# Altium schematic sheet RX_Board.SchDoc (part 2 of 5)
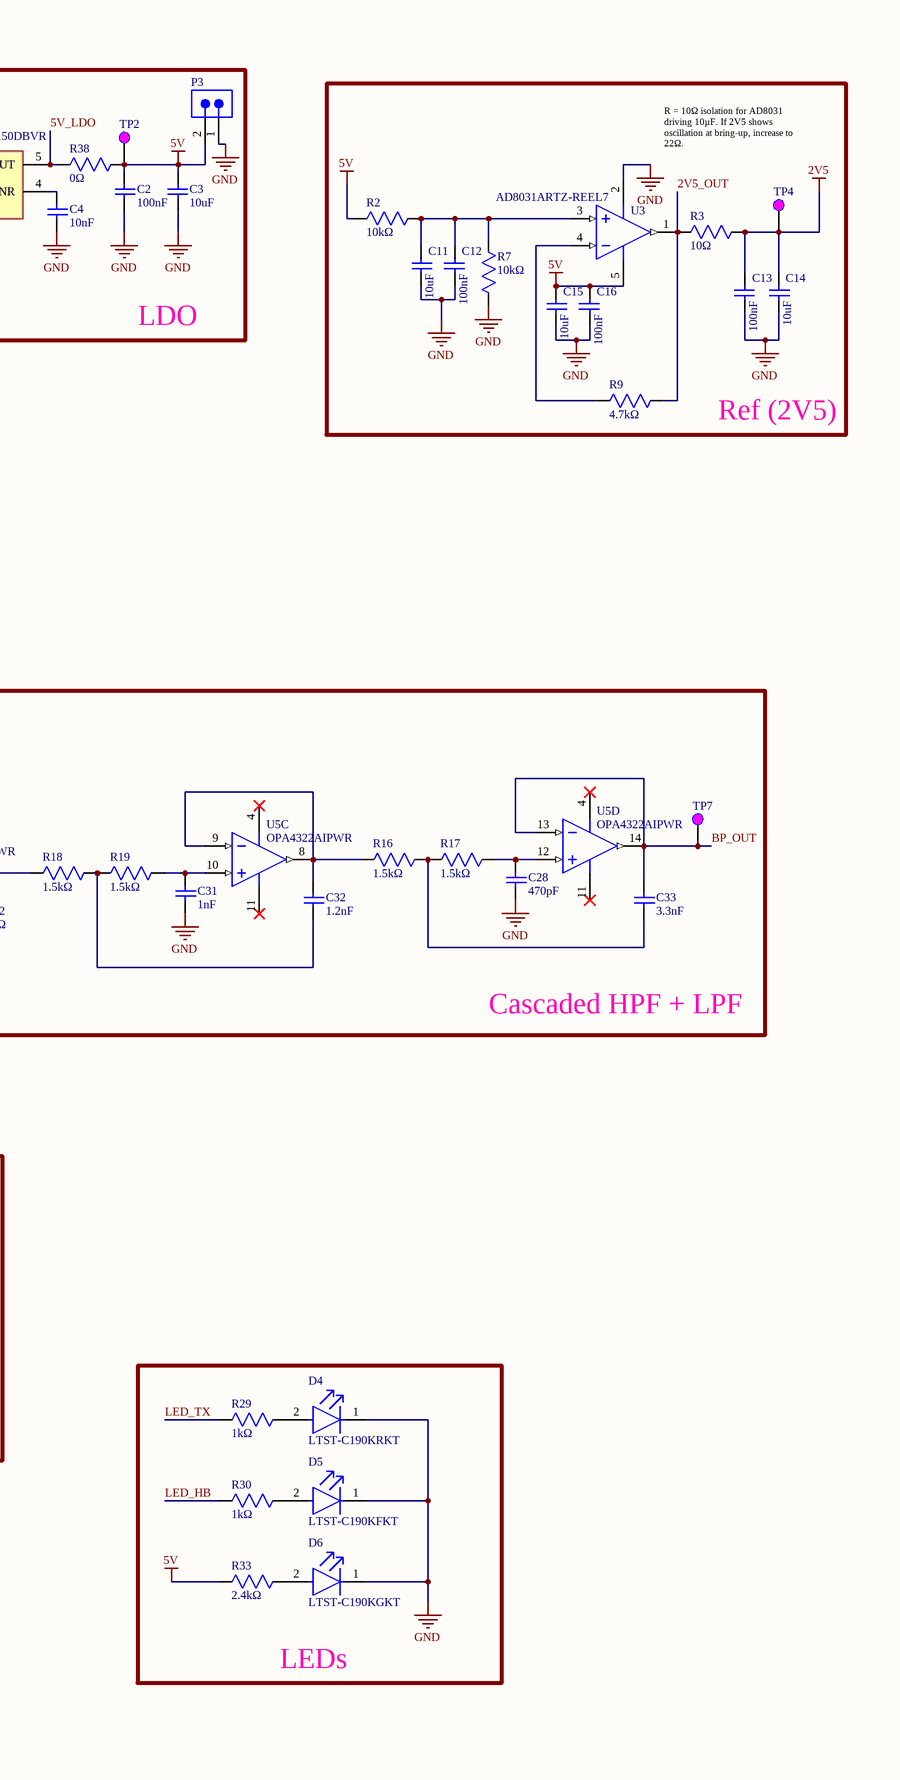
[diagram p2: RX_Board.SchDoc, right]
## Library data of the parts
C1 = CL10C150JB8NNNC: Multilayer Ceramic Capacitor, 15 pF, 50 V, ± 5%, C0G (NP0), 0603 [1608 Metric]; Manufacturer: Samsung Electro-Mechanics; Temperature Coefficient: 30ppm/°C; Voltage: 50V; Supplier: Future Electronics; Supplier Part Number: CL10C150JB8NNNC; Manufacturer Part Number: CL10C150JB8NNNC; RoHS: Compliant; Category: Ceramic Capacitors; Stock: 68000; Pricing: 4000=0.0389, 8000=0.0383, 12000=0.0379, 20000=0.0375, 40000=0.0365 (USD); Value: 15pF; Case/Package: 0603; Case Code (Imperial): 0603; Case Code (Metric): 1608; China RoHS: Compliant; Contact Plating: Tin; Country of Origin: Mainland China, Philippines, South Korea; Depth: 800µm; Dielectric: C0G; Dielectric Material: Ceramic; Export Control Classification Number (ECCN) Code: EAR99; Height: 900µm; Harmonized Tariff Schedule (HTS) Code: 8532.24.00.20; Introduction Date: 2010-02-10; Lead Free: Lead Free; Length: 1.6mm; Lifecycle Status: Production; Material: Ceramic; Max Operating Temperature: 125°C; Min Operating Temperature: -55°C; Mounting Technology: Surface Mount; Number of Terminals: 2; Radiation Hardening: No; REACH SVHC: Unaffected; Schedule B: 8532240020, 8532240020|8532240020, 8532240020|8532240020|8532240020, 8532240020|8532240020|8532240020|8532240020; Thickness: 889µm; Tolerance: 5%; Voltage Rating: 50V; Voltage Rating (DC): 50V; Width: 800µm; ComponentLink1URL: https://datasheet.octopart.com:443/CL10C150JB8NNNC-Samsung-Electro-Mechanics-datasheet-136482401.pdf?src-supplier=IHS; ComponentLink1Description: https://datasheet.octopart.com:443/CL10C150JB8NNNC-Samsung-Electro-Mechanics-datasheet-136482401.pdf?src-supplier=IHS; ComponentLink2URL: https://datasheet.octopart.com/CL10C150JB8NNNC-Samsung-Electro-Mechanics-datasheet-8324245.pdf; ComponentLink2Description: https://datasheet.octopart.com/CL10C150JB8NNNC-Samsung-Electro-Mechanics-datasheet-8324245.pdf; ComponentLink3URL: https://datasheet.octopart.com/CL10C150JB8NNNC-Samsung-Electro-Mechanics-datasheet-97040617.pdf; ComponentLink3Description: https://datasheet.octopart.com/CL10C150JB8NNNC-Samsung-Electro-Mechanics-datasheet-97040617.pdf; ComponentLink4URL: https://datasheet.octopart.com:443/CL10C150JB8NNNC-Samsung-Electro-Mechanics-datasheet-110326846.pdf?src-supplier=Future+Electronics; ComponentLink4Description: https://datasheet.octopart.com:443/CL10C150JB8NNNC-Samsung-Electro-Mechanics-datasheet-110326846.pdf?src-supplier=Future+Electronics; ComponentLink5URL: https://datasheet.octopart.com:443/CL10C150JB8NNNC-Samsung-Electro-Mechanics-datasheet-81461981.pdf?src-supplier=Future+Electronics; ComponentLink5Description: https://datasheet.octopart.com:443/CL10C150JB8NNNC-Samsung-Electro-Mechanics-datasheet-81461981.pdf?src-supplier=Future+Electronics; ComponentLink6URL: https://datasheet.octopart.com:443/CL10C150JB8NNNC-Samsung-datasheet-42280548.pdf?src-supplier=Future+Electronics; ComponentLink6Description: https://datasheet.octopart.com:443/CL10C150JB8NNNC-Samsung-datasheet-42280548.pdf?src-supplier=Future+Electronics; ComponentLink7URL: https://datasheet.octopart.com:443/CL10C150JB8NNNC-Samsung-datasheet-26669126.pdf?src-supplier=Future+Electronics; ComponentLink7Description: https://datasheet.octopart.com:443/CL10C150JB8NNNC-Samsung-datasheet-26669126.pdf?src-supplier=Future+Electronics; ComponentLink8URL: https://datasheet.octopart.com:443/CL10C150JB8NNNC-Samsung-Electro-Mechanics-datasheet-149154145.pdf?src-supplier=Future+Electronics; ComponentLink8Description: https://datasheet.octopart.com:443/CL10C150JB8NNNC-Samsung-Electro-Mechanics-datasheet-149154145.pdf?src-supplier=Future+Electronics; ComponentLink9URL: https://datasheet.octopart.com:443/CL10C150JB8NNNC-Samsung-datasheet-8326407.pdf?src-supplier=TME; ComponentLink9Description: https://datasheet.octopart.com:443/CL10C150JB8NNNC-Samsung-datasheet-8326407.pdf?src-supplier=TME; JLCPCB Part Number: C1644
C2 C7 C9 C12 C13 C16 C18 C20 C23 C25 C34 C36 C38 C40 C44 C46-C48 = CC0603KRX7R9BB104: Multilayer Ceramic Capacitor, CC Series, 0.1 - F, - 10%, X7R, 50 V, 0603 [1608 Metric]; Manufacturer: Yageo Group; Voltage: 50V; Supplier: Avnet; Supplier Part Number: CC0603KRX7R9BB104; Manufacturer Part Number: CC0603KRX7R9BB104; RoHS: Compliant; Category: Ceramic Capacitors; Stock: 6088000; Pricing: 4000=0.00582, 8000=0.00559, 16000=0.00541, 32000=0.00522, 64000=0.00504 (USD); Value: 100nF; Case/Package: 0603; Case Code (Imperial): 0603; Case Code (Metric): 1608; China RoHS: Compliant; Country of Origin: Mainland China, Taiwan; Depth: 800µm; Dielectric: X7R; Dielectric Material: Ceramic; Export Control Classification Number (ECCN) Code: EAR99; Halogen Free: Halogen Free; Height: 800µm; Harmonized Tariff Schedule (HTS) Code: 8532.24.00.20; Introduction Date: 2005-08-18; Lead Free: Lead Free; Length: 1.6mm; Lifecycle Status: Production; Material: Ceramic; Max Operating Temperature: 125°C; Min Operating Temperature: -55°C; Mounting Technology: Surface Mount; Pins: 2; Number of Terminals: 2; Radiation Hardening: No; REACH SVHC: Yes; Schedule B: 8532240020, 8532240020|8532240020, 8532240020|8532240020|8532240020, 8532240020|8532240020|8532240020|8532240020; Termination: SMD/SMT; Thickness: 889µm; Tolerance: 10%; Voltage Rating: 50V; Voltage Rating (DC): 50V; Width: 800µm; ComponentLink1URL: https://datasheet.octopart.com:443/CC0603KRX7R9BB104-Yageo-datasheet-177165144.pdf?src-supplier=IHS; ComponentLink1Description: https://datasheet.octopart.com:443/CC0603KRX7R9BB104-Yageo-datasheet-177165144.pdf?src-supplier=IHS; ComponentLink2URL: https://datasheet.octopart.com:443/CC0603KRX7R9BB104-Yageo-datasheet-82288757.pdf?src-supplier=Upverter; ComponentLink2Description: https://datasheet.octopart.com:443/CC0603KRX7R9BB104-Yageo-datasheet-82288757.pdf?src-supplier=Upverter; ComponentLink3URL: https://datasheet.octopart.com:443/CC0603KRX7R9BB104-Yageo-datasheet-68298032.pdf?src-supplier=Upverter; ComponentLink3Description: https://datasheet.octopart.com:443/CC0603KRX7R9BB104-Yageo-datasheet-68298032.pdf?src-supplier=Upverter; ComponentLink4URL: https://datasheet.octopart.com:443/CC0603KRX7R9BB104-Yageo-Group-datasheet-189192896.pdf?src-supplier=Future+Electronics; ComponentLink4Description: https://datasheet.octopart.com:443/CC0603KRX7R9BB104-Yageo-Group-datasheet-189192896.pdf?src-supplier=Future+Electronics; ComponentLink5URL: https://datasheet.octopart.com:443/CC0603KRX7R9BB104-Yageo-datasheet-12526321.pdf?src-supplier=Future+Electronics; ComponentLink5Description: https://datasheet.octopart.com:443/CC0603KRX7R9BB104-Yageo-datasheet-12526321.pdf?src-supplier=Future+Electronics; ComponentLink6URL: https://datasheet.octopart.com:443/CC0603KRX7R9BB104-Yageo-datasheet-166511530.pdf?src-supplier=Future+Electronics; ComponentLink6Description: https://datasheet.octopart.com:443/CC0603KRX7R9BB104-Yageo-datasheet-166511530.pdf?src-supplier=Future+Electronics; ComponentLink7URL: https://datasheet.octopart.com:443/CC0603KRX7R9BB104-Yageo-datasheet-137700082.pdf?src-supplier=Future+Electronics; ComponentLink7Description: https://datasheet.octopart.com:443/CC0603KRX7R9BB104-Yageo-datasheet-137700082.pdf?src-supplier=Future+Electronics; ComponentLink8URL: https://datasheet.octopart.com:443/CC0603KRX7R9BB104-Yageo-datasheet-137700084.pdf?src-supplier=Future+Electronics; ComponentLink8Description: https://datasheet.octopart.com:443/CC0603KRX7R9BB104-Yageo-datasheet-137700084.pdf?src-supplier=Future+Electronics; ComponentLink9URL: https://datasheet.octopart.com:443/CC0603KRX7R9BB104-Yageo-datasheet-27626582.pdf?src-supplier=Future+Electronics; ComponentLink9Description: https://datasheet.octopart.com:443/CC0603KRX7R9BB104-Yageo-datasheet-27626582.pdf?src-supplier=Future+Electronics; ComponentLink10URL: https://datasheet.octopart.com:443/CC0603KRX7R9BB104-Yageo-datasheet-15895757.pdf?src-supplier=Future+Electronics; ComponentLink10Description: https://datasheet.octopart.com:443/CC0603KRX7R9BB104-Yageo-datasheet-15895757.pdf?src-supplier=Future+Electronics; ComponentLink11URL: https://datasheet.octopart.com:443/CC0603KRX7R9BB104-Yageo-datasheet-8324192.pdf?src-supplier=Future+Electronics; ComponentLink11Description: https://datasheet.octopart.com:443/CC0603KRX7R9BB104-Yageo-datasheet-8324192.pdf?src-supplier=Future+Electronics; ComponentLink12URL: https://datasheet.octopart.com/CC0603KRX7R9BB104-Yageo-datasheet-10883670.pdf; ComponentLink12Description: https://datasheet.octopart.com/CC0603KRX7R9BB104-Yageo-datasheet-10883670.pdf; ComponentLink13URL: https://datasheet.octopart.com:443/CC0603KRX7R9BB104-Yageo-datasheet-181968726.pdf?src-supplier=Newark; ComponentLink13Description: https://datasheet.octopart.com:443/CC0603KRX7R9BB104-Yageo-datasheet-181968726.pdf?src-supplier=Newark; ComponentLink14URL: https://datasheet.octopart.com:443/CC0603KRX7R9BB104-Yageo-datasheet-499490.pdf?src-supplier=Newark; ComponentLink14Description: https://datasheet.octopart.com:443/CC0603KRX7R9BB104-Yageo-datasheet-499490.pdf?src-supplier=Newark; ComponentLink15URL: https://datasheet.octopart.com:443/CC0603KRX7R9BB104-Yageo-datasheet-62336348.pdf?src-supplier=Newark; ComponentLink15Description: https://datasheet.octopart.com:443/CC0603KRX7R9BB104-Yageo-datasheet-62336348.pdf?src-supplier=Newark; ComponentLink16URL: https://datasheet.octopart.com:443/CC0603KRX7R9BB104-Yageo-datasheet-147453679.pdf?src-supplier=Newark; ComponentLink16Description: https://datasheet.octopart.com:443/CC0603KRX7R9BB104-Yageo-datasheet-147453679.pdf?src-supplier=Newark; ComponentLink17URL: https://datasheet.octopart.com:443/CC0603KRX7R9BB104-Yageo-datasheet-151948686.pdf?src-supplier=Farnell; ComponentLink17Description: https://datasheet.octopart.com:443/CC0603KRX7R9BB104-Yageo-datasheet-151948686.pdf?src-supplier=Farnell; ComponentLink18URL: https://datasheet.octopart.com:443/CC0603KRX7R9BB104-Yageo-datasheet-500777.pdf?src-supplier=Farnell; ComponentLink18Description: https://datasheet.octopart.com:443/CC0603KRX7R9BB104-Yageo-datasheet-500777.pdf?src-supplier=Farnell; ComponentLink19URL: https://datasheet.octopart.com:443/CC0603KRX7R9BB104-Yageo-datasheet-178019014.pdf?src-supplier=Burklin+Elektronik; ComponentLink19Description: https://datasheet.octopart.com:443/CC0603KRX7R9BB104-Yageo-datasheet-178019014.pdf?src-supplier=Burklin+Elektronik; ComponentLink20URL: https://datasheet.octopart.com:443/CC0603KRX7R9BB104-Yageo-Group-datasheet-165992755.pdf?src-supplier=ODG+(Origin+Data+Global); ComponentLink20Description: https://datasheet.octopart.com:443/CC0603KRX7R9BB104-Yageo-Group-datasheet-165992755.pdf?src-supplier=ODG+(Origin+Data+Global); ComponentLink21URL: https://datasheet.octopart.com:443/CC0603KRX7R9BB104-Yageo-datasheet-140260305.pdf?src-supplier=SOS+electronic; ComponentLink21Description: https://datasheet.octopart.com:443/CC0603KRX7R9BB104-Yageo-datasheet-140260305.pdf?src-supplier=SOS+electronic; ComponentLink22URL: https://datasheet.octopart.com:443/CC0603KRX7R9BB104-Yageo-datasheet-120101875.pdf?src-supplier=Megastar; ComponentLink22Description: https://datasheet.octopart.com:443/CC0603KRX7R9BB104-Yageo-datasheet-120101875.pdf?src-supplier=Megastar; ComponentLink23URL: https://datasheet.octopart.com:443/CC0603KRX7R9BB104-Yageo-datasheet-8701427.pdf?src-supplier=element14; ComponentLink23Description: https://datasheet.octopart.com:443/CC0603KRX7R9BB104-Yageo-datasheet-8701427.pdf?src-supplier=element14; ComponentLink24URL: https://datasheet.octopart.com:443/CC0603KRX7R9BB104-Yageo-datasheet-5301394.pdf?src-supplier=element14; ComponentLink24Description: https://datasheet.octopart.com:443/CC0603KRX7R9BB104-Yageo-datasheet-5301394.pdf?src-supplier=element14; ComponentLink25URL: https://datasheet.octopart.com:443/CC0603KRX7R9BB104-Yageo-datasheet-17600895.pdf?src-supplier=TME; ComponentLink25Description: https://datasheet.octopart.com:443/CC0603KRX7R9BB104-Yageo-datasheet-17600895.pdf?src-supplier=TME; ComponentLink26URL: http://sigma.octopart.com:80/15889575/rohs_statement/Yageo-CC0603KRX7R9BB104.pdf?src-supplier=Compliance+Statements; ComponentLink26Description: http://sigma.octopart.com:80/15889575/rohs_statement/Yageo-CC0603KRX7R9BB104.pdf?src-supplier=Compliance+Statements; ComponentLink27URL: http://sigma.octopart.com:80/conflict_mineral_statement/Yageo-company-3.pdf?src-supplier=Compliance+Statements; ComponentLink27Description: http://sigma.octopart.com:80/conflict_mineral_statement/Yageo-company-3.pdf?src-supplier=Compliance+Statements; JLCPCB Part Number: C14663
C3 C6 C8 C11 C14 C15 C17 C21 C22 C37 C41 = CL10A106MA8NRNC: 25V 10uF X5R ±20% 0603 Multilayer Ceramic Capacitors MLCC - SMD/SMT ROHS; Manufacturer: Samsung Electro-Mechanics; Value: 10µF; Supplier: Avnet; Supplier Part Number: CL10A106MA8NRNC; Manufacturer Part Number: CL10A106MA8NRNC; RoHS: Compliant; Category: Ceramic Capacitors; Stock: 6860000; Pricing: 4000=0.03585, 8000=0.03513, 16000=0.03443, 32000=0.03377, 64000=0.03313 (USD); Case/Package: 0603; Case Code (Imperial): 0603; Case Code (Metric): 1608; China RoHS: Compliant; Contact Plating: Tin; Country of Origin: Mainland China, Philippines, South Korea; Dielectric: X5R; Dielectric Material: Ceramic; Export Control Classification Number (ECCN) Code: EAR99; Height: 800µm; Harmonized Tariff Schedule (HTS) Code: 8532.24.00.20; Introduction Date: 2013-01-16; Lead Free: Lead Free; Length: 1.6mm; Lifecycle Status: Production; Material: Ceramic; Max Operating Temperature: 85°C; Min Operating Temperature: -55°C; Mounting Technology: Surface Mount; Number of Terminals: 2; Packaging: Tape & Reel (TR); REACH SVHC: Yes; Schedule B: 8532240020, 8532240020|8532240020|8532240020|8532240020|8532240020|8532240020|8532240020|8532240020|8532240020|8532240020|8532240020, 8532240020|8532240020|8532240020|8532240020|8532240020|8532240020|8532240020|8532240020|8532240020|8532240020|8532240020|8532240020, 8532240020|8532240020|8532240020|8532240020|8532240020|8532240020|8532240020|8532240020|8532240020|8532240020|8532240020|8532240020|8532240020; Termination: Wraparound; Thickness: 889µm; Tolerance: 20%; Voltage Rating: 25V; Voltage Rating (DC): 25V; Width: 800µm; ComponentLink1URL: https://datasheet.octopart.com:443/CL10A106MA8NRNC-Samsung-Electro-Mechanics-datasheet-182019172.pdf?src-supplier=IHS; ComponentLink1Description: https://datasheet.octopart.com:443/CL10A106MA8NRNC-Samsung-Electro-Mechanics-datasheet-182019172.pdf?src-supplier=IHS; ComponentLink2URL: https://datasheet.octopart.com:443/CL10A106MA8NRNC-Samsung-Electro-Mechanics-datasheet-137745063.pdf?src-supplier=Future+Electronics; ComponentLink2Description: https://datasheet.octopart.com:443/CL10A106MA8NRNC-Samsung-Electro-Mechanics-datasheet-137745063.pdf?src-supplier=Future+Electronics; ComponentLink3URL: https://datasheet.octopart.com:443/CL10A106MA8NRNC-Samsung-Electro-Mechanics-datasheet-136031756.pdf?src-supplier=Future+Electronics; ComponentLink3Description: https://datasheet.octopart.com:443/CL10A106MA8NRNC-Samsung-Electro-Mechanics-datasheet-136031756.pdf?src-supplier=Future+Electronics; ComponentLink4URL: https://datasheet.octopart.com:443/CL10A106MA8NRNC-Samsung-Electro-Mechanics-datasheet-110226291.pdf?src-supplier=Future+Electronics; ComponentLink4Description: https://datasheet.octopart.com:443/CL10A106MA8NRNC-Samsung-Electro-Mechanics-datasheet-110226291.pdf?src-supplier=Future+Electronics; ComponentLink5URL: https://datasheet.octopart.com:443/CL10A106MA8NRNC-Samsung-Electro-Mechanics-datasheet-87580073.pdf?src-supplier=Future+Electronics; ComponentLink5Description: https://datasheet.octopart.com:443/CL10A106MA8NRNC-Samsung-Electro-Mechanics-datasheet-87580073.pdf?src-supplier=Future+Electronics; ComponentLink6URL: https://datasheet.octopart.com:443/CL10A106MA8NRNC-Samsung-Electro-Mechanics-datasheet-68300265.pdf?src-supplier=Future+Electronics; ComponentLink6Description: https://datasheet.octopart.com:443/CL10A106MA8NRNC-Samsung-Electro-Mechanics-datasheet-68300265.pdf?src-supplier=Future+Electronics; ComponentLink7URL: https://datasheet.octopart.com:443/CL10A106MA8NRNC-Samsung-datasheet-66660282.pdf?src-supplier=Future+Electronics; ComponentLink7Description: https://datasheet.octopart.com:443/CL10A106MA8NRNC-Samsung-datasheet-66660282.pdf?src-supplier=Future+Electronics; ComponentLink8URL: https://datasheet.octopart.com:443/CL10A106MA8NRNC-Samsung-datasheet-48647236.pdf?src-supplier=Future+Electronics; ComponentLink8Description: https://datasheet.octopart.com:443/CL10A106MA8NRNC-Samsung-datasheet-48647236.pdf?src-supplier=Future+Electronics; ComponentLink9URL: https://datasheet.octopart.com:443/CL10A106MA8NRNC-Samsung-datasheet-39118733.pdf?src-supplier=Future+Electronics; ComponentLink9Description: https://datasheet.octopart.com:443/CL10A106MA8NRNC-Samsung-datasheet-39118733.pdf?src-supplier=Future+Electronics; ComponentLink10URL: https://datasheet.octopart.com:443/CL10A106MA8NRNC-Samsung-Electro-Mechanics-datasheet-149156483.pdf?src-supplier=Future+Electronics; ComponentLink10Description: https://datasheet.octopart.com:443/CL10A106MA8NRNC-Samsung-Electro-Mechanics-datasheet-149156483.pdf?src-supplier=Future+Electronics; JLCPCB Part Number: C96446
C4 = CC0603JRX7R9BB103: Surface Mount Ceramic Multilayer Capacitor 0.01uF 5% X7R 50V 0603 Paper T/R; Manufacturer: Yageo Group; Supplier: Newark; Supplier Part Number: CC0603JRX7R9BB103; Manufacturer Part Number: CC0603JRX7R9BB103; RoHS: Compliant; Category: Ceramic Capacitors; Stock: 32119; Pricing: 10=0.03, 20=0.029, 30=0.028, 50=0.027, 100=0.026, 250=0.023, 500=0.019, 1000=0.017 (USD); Value: 10nF; Case/Package: 0603; Case Code (Imperial): 0603; Case Code (Metric): 1608; China RoHS: Compliant; Composition: Ceramic; Depth: 800µm; Dielectric: X7R; Dielectric Material: Ceramic; Halogen Free: Halogen Free; Height: 800µm; Lead Free: Lead Free; Length: 1.6mm; Lifecycle Status: Production; Max Operating Temperature: 125°C; Min Operating Temperature: -55°C; Mounting Technology: Surface Mount; Pins: 2; Number of Terminals: 2; Radiation Hardening: No; REACH SVHC: Unaffected; Schedule B: 8532240020, 8532240020|8532240020, 8532240020|8532240020|8532240020, 8532240020|8532240020|8532240020|8532240020; Termination: SMD/SMT; Thickness: 889µm; Tolerance: 5%; Voltage Rating: 50V; Voltage Rating (DC): 50V; Width: 800µm; ComponentLink1URL: https://datasheet.octopart.com:443/CC0603JRX7R9BB103-Yageo-datasheet-177165144.pdf?src-supplier=IHS; ComponentLink1Description: https://datasheet.octopart.com:443/CC0603JRX7R9BB103-Yageo-datasheet-177165144.pdf?src-supplier=IHS; ComponentLink2URL: https://datasheet.octopart.com/CC0603JRX7R9BB103-Yageo-datasheet-10883670.pdf; ComponentLink2Description: https://datasheet.octopart.com/CC0603JRX7R9BB103-Yageo-datasheet-10883670.pdf; ComponentLink3URL: https://datasheet.octopart.com:443/CC0603JRX7R9BB103-Yageo-datasheet-147453679.pdf?src-supplier=Newark; ComponentLink3Description: https://datasheet.octopart.com:443/CC0603JRX7R9BB103-Yageo-datasheet-147453679.pdf?src-supplier=Newark; ComponentLink4URL: https://datasheet.octopart.com:443/CC0603JRX7R9BB103-Yageo-datasheet-140260305.pdf?src-supplier=Farnell; ComponentLink4Description: https://datasheet.octopart.com:443/CC0603JRX7R9BB103-Yageo-datasheet-140260305.pdf?src-supplier=Farnell; ComponentLink5URL: https://datasheet.octopart.com:443/CC0603JRX7R9BB103-Yageo-datasheet-181968368.pdf?src-supplier=Farnell; ComponentLink5Description: https://datasheet.octopart.com:443/CC0603JRX7R9BB103-Yageo-datasheet-181968368.pdf?src-supplier=Farnell; ComponentLink6URL: https://datasheet.octopart.com:443/CC0603JRX7R9BB103-Yageo-datasheet-62336348.pdf?src-supplier=element14+APAC; ComponentLink6Description: https://datasheet.octopart.com:443/CC0603JRX7R9BB103-Yageo-datasheet-62336348.pdf?src-supplier=element14+APAC; ComponentLink7URL: https://datasheet.octopart.com:443/CC0603JRX7R9BB103-Yageo-datasheet-499490.pdf?src-supplier=element14; ComponentLink7Description: https://datasheet.octopart.com:443/CC0603JRX7R9BB103-Yageo-datasheet-499490.pdf?src-supplier=element14; ComponentLink8URL: https://datasheet.octopart.com:443/CC0603JRX7R9BB103-Yageo-datasheet-8701427.pdf?src-supplier=element14; ComponentLink8Description: https://datasheet.octopart.com:443/CC0603JRX7R9BB103-Yageo-datasheet-8701427.pdf?src-supplier=element14; ComponentLink9URL: https://datasheet.octopart.com:443/CC0603JRX7R9BB103-Yageo-datasheet-5301394.pdf?src-supplier=element14; ComponentLink9Description: https://datasheet.octopart.com:443/CC0603JRX7R9BB103-Yageo-datasheet-5301394.pdf?src-supplier=element14; ComponentLink10URL: https://datasheet.octopart.com:443/CC0603JRX7R9BB103-Yageo-datasheet-166511530.pdf?src-supplier=Future+Electronics; ComponentLink10Description: https://datasheet.octopart.com:443/CC0603JRX7R9BB103-Yageo-datasheet-166511530.pdf?src-supplier=Future+Electronics; ComponentLink11URL: https://datasheet.octopart.com:443/CC0603JRX7R9BB103-Yageo-datasheet-137700082.pdf?src-supplier=Future+Electronics; ComponentLink11Description: https://datasheet.octopart.com:443/CC0603JRX7R9BB103-Yageo-datasheet-137700082.pdf?src-supplier=Future+Electronics; ComponentLink12URL: https://datasheet.octopart.com:443/CC0603JRX7R9BB103-Yageo-datasheet-137700084.pdf?src-supplier=Future+Electronics; ComponentLink12Description: https://datasheet.octopart.com:443/CC0603JRX7R9BB103-Yageo-datasheet-137700084.pdf?src-supplier=Future+Electronics; ComponentLink13URL: https://datasheet.octopart.com:443/CC0603JRX7R9BB103-Yageo-datasheet-27626582.pdf?src-supplier=Future+Electronics; ComponentLink13Description: https://datasheet.octopart.com:443/CC0603JRX7R9BB103-Yageo-datasheet-27626582.pdf?src-supplier=Future+Electronics; ComponentLink14URL: https://datasheet.octopart.com:443/CC0603JRX7R9BB103-Yageo-datasheet-15895757.pdf?src-supplier=Future+Electronics; ComponentLink14Description: https://datasheet.octopart.com:443/CC0603JRX7R9BB103-Yageo-datasheet-15895757.pdf?src-supplier=Future+Electronics; ComponentLink15URL: https://datasheet.octopart.com:443/CC0603JRX7R9BB103-Yageo-datasheet-12526321.pdf?src-supplier=Future+Electronics; ComponentLink15Description: https://datasheet.octopart.com:443/CC0603JRX7R9BB103-Yageo-datasheet-12526321.pdf?src-supplier=Future+Electronics; ComponentLink16URL: https://datasheet.octopart.com:443/CC0603JRX7R9BB103-Yageo-Group-datasheet-165992755.pdf?src-supplier=ODG+(Origin+Data+Global); ComponentLink16Description: https://datasheet.octopart.com:443/CC0603JRX7R9BB103-Yageo-Group-datasheet-165992755.pdf?src-supplier=ODG+(Origin+Data+Global); ComponentLink17URL: https://datasheet.octopart.com:443/CC0603JRX7R9BB103-Yageo-datasheet-151948686.pdf?src-supplier=TME; ComponentLink17Description: https://datasheet.octopart.com:443/CC0603JRX7R9BB103-Yageo-datasheet-151948686.pdf?src-supplier=TME; ComponentLink18URL: http://sigma.octopart.com:80/conflict_mineral_statement/Yageo-company-3.pdf?src-supplier=Compliance+Statements; ComponentLink18Description: http://sigma.octopart.com:80/conflict_mineral_statement/Yageo-company-3.pdf?src-supplier=Compliance+Statements; ComponentLink19URL: http://sigma.octopart.com:80/rohs_statement/Yageo-company-2.pdf?src-supplier=Compliance+Statements; ComponentLink19Description: http://sigma.octopart.com:80/rohs_statement/Yageo-company-2.pdf?src-supplier=Compliance+Statements; JLCPCB Part Number: C115056
C5 = RVT1E101M0607: Capacitor Polarised; Manufacturer_Name: ROQANG; Datasheet Link: https://jlcpcb.com/partdetail/ROQANG-RVT1E101M0607/C72477; Height: 8mm; Manufacturer_Part_Number: RVT1E101M0607; JLCPCB Part Number: C72477; Value: 100uF
C10 = CL10A475KA8NQNC: 25V 4.7uF X5R 卤10% 0603 Multilayer Ceramic Capacitors MLCC - SMD/SMT ROHS; Manufacturer: Samsung Electro-Mechanics; Tolerance: 10%; Supplier: Future Electronics; Supplier Part Number: CL10A475KA8NQNC; Manufacturer Part Number: CL10A475KA8NQNC; RoHS: Compliant; Category: Ceramic Capacitors; Stock: 708000; Pricing: 4000=0.365 (USD); Value: 4.7µF; Case/Package: 0603; Case Code (Imperial): 0603; Case Code (Metric): 1608; China RoHS: Compliant; Contact Plating: Tin; Country of Origin: Mainland China, Philippines, South Korea; Depth: 800µm; Dielectric: X5R; Dielectric Material: Ceramic; Export Control Classification Number (ECCN) Code: EAR99; Height: 950µm; Harmonized Tariff Schedule (HTS) Code: 8532.24.00.20; Introduction Date: 2010-04-05; Lead Free: Lead Free; Length: 1.6mm; Lifecycle Status: Production; Material: Ceramic; Max Operating Temperature: 85°C; Min Operating Temperature: -55°C; Mounting Technology: Surface Mount; Number of Terminals: 2; Packaging: Tape & Reel (TR); REACH SVHC: Unaffected; Schedule B: 8532240020, 8532240020|8532240020, 8532240020|8532240020|8532240020, 8532240020|8532240020|8532240020|8532240020; Termination: Wraparound; Thickness: 889µm; Voltage Rating: 25V; Voltage Rating (DC): 25V; Width: 800µm; ComponentLink1URL: https://datasheet.octopart.com:443/CL10A475KA8NQNC-Samsung-Electro-Mechanics-datasheet-182019420.pdf?src-supplier=IHS; ComponentLink1Description: https://datasheet.octopart.com:443/CL10A475KA8NQNC-Samsung-Electro-Mechanics-datasheet-182019420.pdf?src-supplier=IHS; ComponentLink2URL: https://datasheet.octopart.com:443/CL10A475KA8NQNC-Samsung-Electro-Mechanics-datasheet-136031786.pdf?src-supplier=Samsung+SCT; ComponentLink2Description: https://datasheet.octopart.com:443/CL10A475KA8NQNC-Samsung-Electro-Mechanics-datasheet-136031786.pdf?src-supplier=Samsung+SCT; ComponentLink3URL: https://datasheet.octopart.com:443/CL10A475KA8NQNC-Samsung-Electro-Mechanics-datasheet-133510619.pdf?src-supplier=Future+Electronics; ComponentLink3Description: https://datasheet.octopart.com:443/CL10A475KA8NQNC-Samsung-Electro-Mechanics-datasheet-133510619.pdf?src-supplier=Future+Electronics; ComponentLink4URL: https://datasheet.octopart.com:443/CL10A475KA8NQNC-Samsung-Electro-Mechanics-datasheet-68304637.pdf?src-supplier=Future+Electronics; ComponentLink4Description: https://datasheet.octopart.com:443/CL10A475KA8NQNC-Samsung-Electro-Mechanics-datasheet-68304637.pdf?src-supplier=Future+Electronics; ComponentLink5URL: https://datasheet.octopart.com:443/CL10A475KA8NQNC-Samsung-datasheet-66660282.pdf?src-supplier=Future+Electronics; ComponentLink5Description: https://datasheet.octopart.com:443/CL10A475KA8NQNC-Samsung-datasheet-66660282.pdf?src-supplier=Future+Electronics; ComponentLink6URL: https://datasheet.octopart.com:443/CL10A475KA8NQNC-Samsung-datasheet-42901174.pdf?src-supplier=Future+Electronics; ComponentLink6Description: https://datasheet.octopart.com:443/CL10A475KA8NQNC-Samsung-datasheet-42901174.pdf?src-supplier=Future+Electronics; ComponentLink7URL: https://datasheet.octopart.com:443/CL10A475KA8NQNC-Samsung-Electro-Mechanics-datasheet-100454038.pdf?src-supplier=Future+Electronics; ComponentLink7Description: https://datasheet.octopart.com:443/CL10A475KA8NQNC-Samsung-Electro-Mechanics-datasheet-100454038.pdf?src-supplier=Future+Electronics; ComponentLink8URL: https://datasheet.octopart.com:443/CL10A475KA8NQNC-Samsung-Electro-Mechanics-datasheet-149158805.pdf?src-supplier=Future+Electronics; ComponentLink8Description: https://datasheet.octopart.com:443/CL10A475KA8NQNC-Samsung-Electro-Mechanics-datasheet-149158805.pdf?src-supplier=Future+Electronics; JLCPCB Part Number: C69335
C19 C39 = CC0603KRX7R9BB682: Surface Mount Ceramic Multilayer Capacitor 0.0068uF 10% X7R 50V 0603 Paper T/R; Manufacturer: Yageo Group; Insulation Resistance: 100GΩ; Supplier: Avnet; Supplier Part Number: CC0603KRX7R9BB682; Manufacturer Part Number: CC0603KRX7R9BB682; RoHS: Compliant; Category: Ceramic Capacitors; Stock: 56000; Pricing: 4000=0.00678 (USD); Value: 6.8nF; Case/Package: 0603; Case Code (Imperial): 0603; Case Code (Metric): 1608; China RoHS: Compliant; Composition: Ceramic; Depth: 800µm; Dielectric: X7R; Dielectric Material: Ceramic; Halogen Free: Halogen Free; Height: 800µm; Lead Free: Lead Free; Length: 1.6mm; Lifecycle Status: Production; Material: Ceramic; Max Operating Temperature: 125°C; Min Operating Temperature: -55°C; Mounting Technology: Surface Mount; Pins: 2; Number of Terminals: 2; Radiation Hardening: No; REACH SVHC: Unaffected; Schedule B: 8532240020, 8532240020|8532240020, 8532240020|8532240020|8532240020, 8532240020|8532240020|8532240020|8532240020; Termination: SMD/SMT; Thickness: 889µm; Tolerance: 10%; Voltage: 50V; Voltage Rating: 50V; Voltage Rating (AC): 50V; Voltage Rating (DC): 50V; Width: 800µm; ComponentLink1URL: https://datasheet.octopart.com:443/CC0603KRX7R9BB682-Yageo-datasheet-177165144.pdf?src-supplier=IHS; ComponentLink1Description: https://datasheet.octopart.com:443/CC0603KRX7R9BB682-Yageo-datasheet-177165144.pdf?src-supplier=IHS; ComponentLink2URL: https://datasheet.octopart.com:443/CC0603KRX7R9BB682-Yageo-datasheet-82288757.pdf?src-supplier=Upverter; ComponentLink2Description: https://datasheet.octopart.com:443/CC0603KRX7R9BB682-Yageo-datasheet-82288757.pdf?src-supplier=Upverter; ComponentLink3URL: https://datasheet.octopart.com/CC0603KRX7R9BB682-Yageo-datasheet-10883670.pdf; ComponentLink3Description: https://datasheet.octopart.com/CC0603KRX7R9BB682-Yageo-datasheet-10883670.pdf; ComponentLink4URL: https://datasheet.octopart.com:443/CC0603KRX7R9BB682-Yageo-datasheet-147453679.pdf?src-supplier=Farnell; ComponentLink4Description: https://datasheet.octopart.com:443/CC0603KRX7R9BB682-Yageo-datasheet-147453679.pdf?src-supplier=Farnell; ComponentLink5URL: https://datasheet.octopart.com:443/CC0603KRX7R9BB682-Yageo-Group-datasheet-188689702.pdf?src-supplier=Farnell; ComponentLink5Description: https://datasheet.octopart.com:443/CC0603KRX7R9BB682-Yageo-Group-datasheet-188689702.pdf?src-supplier=Farnell; ComponentLink6URL: https://datasheet.octopart.com:443/CC0603KRX7R9BB682-Yageo-datasheet-500777.pdf?src-supplier=Farnell; ComponentLink6Description: https://datasheet.octopart.com:443/CC0603KRX7R9BB682-Yageo-datasheet-500777.pdf?src-supplier=Farnell; ComponentLink7URL: https://datasheet.octopart.com:443/CC0603KRX7R9BB682-Yageo-datasheet-5301394.pdf?src-supplier=Newark; ComponentLink7Description: https://datasheet.octopart.com:443/CC0603KRX7R9BB682-Yageo-datasheet-5301394.pdf?src-supplier=Newark; ComponentLink8URL: https://datasheet.octopart.com:443/CC0603KRX7R9BB682-Yageo-datasheet-62336348.pdf?src-supplier=element14+APAC; ComponentLink8Description: https://datasheet.octopart.com:443/CC0603KRX7R9BB682-Yageo-datasheet-62336348.pdf?src-supplier=element14+APAC; ComponentLink9URL: https://datasheet.octopart.com:443/CC0603KRX7R9BB682-Yageo-datasheet-151948686.pdf?src-supplier=TME; ComponentLink9Description: https://datasheet.octopart.com:443/CC0603KRX7R9BB682-Yageo-datasheet-151948686.pdf?src-supplier=TME; ComponentLink10URL: https://datasheet.octopart.com:443/CC0603KRX7R9BB682-Yageo-datasheet-499490.pdf?src-supplier=element14; ComponentLink10Description: https://datasheet.octopart.com:443/CC0603KRX7R9BB682-Yageo-datasheet-499490.pdf?src-supplier=element14; ComponentLink11URL: https://datasheet.octopart.com:443/CC0603KRX7R9BB682-Yageo-datasheet-8701427.pdf?src-supplier=element14; ComponentLink11Description: https://datasheet.octopart.com:443/CC0603KRX7R9BB682-Yageo-datasheet-8701427.pdf?src-supplier=element14; ComponentLink12URL: https://datasheet.octopart.com:443/CC0603KRX7R9BB682-Yageo-Group-datasheet-184163374.pdf?src-supplier=LCSC; ComponentLink12Description: https://datasheet.octopart.com:443/CC0603KRX7R9BB682-Yageo-Group-datasheet-184163374.pdf?src-supplier=LCSC; ComponentLink13URL: https://datasheet.octopart.com:443/CC0603KRX7R9BB682-Yageo-datasheet-166511530.pdf?src-supplier=Future+Electronics; ComponentLink13Description: https://datasheet.octopart.com:443/CC0603KRX7R9BB682-Yageo-datasheet-166511530.pdf?src-supplier=Future+Electronics; ComponentLink14URL: https://datasheet.octopart.com:443/CC0603KRX7R9BB682-Yageo-datasheet-137700082.pdf?src-supplier=Future+Electronics; ComponentLink14Description: https://datasheet.octopart.com:443/CC0603KRX7R9BB682-Yageo-datasheet-137700082.pdf?src-supplier=Future+Electronics; ComponentLink15URL: https://datasheet.octopart.com:443/CC0603KRX7R9BB682-Yageo-datasheet-137700084.pdf?src-supplier=Future+Electronics; ComponentLink15Description: https://datasheet.octopart.com:443/CC0603KRX7R9BB682-Yageo-datasheet-137700084.pdf?src-supplier=Future+Electronics; ComponentLink16URL: https://datasheet.octopart.com:443/CC0603KRX7R9BB682-Yageo-datasheet-27626582.pdf?src-supplier=Future+Electronics; ComponentLink16Description: https://datasheet.octopart.com:443/CC0603KRX7R9BB682-Yageo-datasheet-27626582.pdf?src-supplier=Future+Electronics; ComponentLink17URL: https://datasheet.octopart.com:443/CC0603KRX7R9BB682-Yageo-datasheet-15895757.pdf?src-supplier=Future+Electronics; ComponentLink17Description: https://datasheet.octopart.com:443/CC0603KRX7R9BB682-Yageo-datasheet-15895757.pdf?src-supplier=Future+Electronics; ComponentLink18URL: https://datasheet.octopart.com:443/CC0603KRX7R9BB682-Yageo-datasheet-12526321.pdf?src-supplier=Future+Electronics; ComponentLink18Description: https://datasheet.octopart.com:443/CC0603KRX7R9BB682-Yageo-datasheet-12526321.pdf?src-supplier=Future+Electronics; ComponentLink19URL: https://datasheet.octopart.com:443/CC0603KRX7R9BB682-Yageo-datasheet-8324192.pdf?src-supplier=Future+Electronics; ComponentLink19Description: https://datasheet.octopart.com:443/CC0603KRX7R9BB682-Yageo-datasheet-8324192.pdf?src-supplier=Future+Electronics; ComponentLink20URL: https://datasheet.octopart.com:443/CC0603KRX7R9BB682-Yageo-datasheet-178019221.pdf?src-supplier=Burklin+Elektronik; ComponentLink20Description: https://datasheet.octopart.com:443/CC0603KRX7R9BB682-Yageo-datasheet-178019221.pdf?src-supplier=Burklin+Elektronik; ComponentLink21URL: https://datasheet.octopart.com:443/CC0603KRX7R9BB682-Yageo-Group-datasheet-165992755.pdf?src-supplier=ODG+(Origin+Data+Global); ComponentLink21Description: https://datasheet.octopart.com:443/CC0603KRX7R9BB682-Yageo-Group-datasheet-165992755.pdf?src-supplier=ODG+(Origin+Data+Global); ComponentLink22URL: https://datasheet.octopart.com:443/CC0603KRX7R9BB682-Yageo-datasheet-140260305.pdf?src-supplier=SOS+electronic; ComponentLink22Description: https://datasheet.octopart.com:443/CC0603KRX7R9BB682-Yageo-datasheet-140260305.pdf?src-supplier=SOS+electronic; ComponentLink23URL: https://datasheet.octopart.com:443/CC0603KRX7R9BB682-Yageo-datasheet-118396.pdf?src-supplier=DigiKey; ComponentLink23Description: https://datasheet.octopart.com:443/CC0603KRX7R9BB682-Yageo-datasheet-118396.pdf?src-supplier=DigiKey; ComponentLink24URL: http://sigma.octopart.com:80/conflict_mineral_statement/Yageo-company-3.pdf?src-supplier=Compliance+Statements; ComponentLink24Description: http://sigma.octopart.com:80/conflict_mineral_statement/Yageo-company-3.pdf?src-supplier=Compliance+Statements; ComponentLink25URL: http://sigma.octopart.com:80/rohs_statement/Yageo-company-2.pdf?src-supplier=Compliance+Statements; ComponentLink25Description: http://sigma.octopart.com:80/rohs_statement/Yageo-company-2.pdf?src-supplier=Compliance+Statements; JLCPCB Part Number: C107097
C24 = CC0603CRNPO9BN6R8: Surface Mount Ceramic Multilayer Capacitor 6.8pF 0.25pF C0G 50V 0603 Paper T/R; Manufacturer: Yageo Group; Temperature Coefficient: 30ppm/°C; Supplier: Newark; Supplier Part Number: CC0603CRNPO9BN6R8; Manufacturer Part Number: CC0603CRNPO9BN6R8; RoHS: Compliant; Category: Ceramic Capacitors; Stock: 9772; Pricing: 10=0.041, 20=0.04, 30=0.038, 50=0.037, 100=0.035, 250=0.031, 500=0.026, 1000=0.025 (USD); Value: 6.8pF; Case/Package: 0603; Case Code (Imperial): 0603; Case Code (Metric): 1608; China RoHS: Compliant; Composition: Ceramic; Country of Origin: Mainland China, Taiwan; Depth: 800µm; Dielectric: C0G; Dielectric Material: Ceramic; Export Control Classification Number (ECCN) Code: EAR99; Halogen Free: Halogen Free; Height: 800µm; Harmonized Tariff Schedule (HTS) Code: 8532.24.00.20; Introduction Date: 2003-08-13; Lead Free: Lead Free; Length: 1.6mm; Lifecycle Status: Production; Max Operating Temperature: 125°C; Min Operating Temperature: -55°C; Mounting Technology: Surface Mount; Number of Terminals: 2; Packaging: Tape and Reel; Radiation Hardening: No; REACH SVHC: Unaffected; Schedule B: 8532240020, 8532240020|8532240020|8532240020|8532240020|8532240020; Termination: SMD/SMT; Thickness: 889µm; Voltage: 50V; Voltage Rating: 50V; Voltage Rating (DC): 50V; Weight: 2.012816mg; Width: 800µm; ComponentLink1URL: https://datasheet.octopart.com:443/CC0603CRNPO9BN6R8-Yageo-datasheet-182140217.pdf?src-supplier=IHS; ComponentLink1Description: https://datasheet.octopart.com:443/CC0603CRNPO9BN6R8-Yageo-datasheet-182140217.pdf?src-supplier=IHS; ComponentLink2URL: https://datasheet.octopart.com:443/CC0603CRNPO9BN6R8-Yageo-datasheet-182029515.pdf?src-supplier=Farnell; ComponentLink2Description: https://datasheet.octopart.com:443/CC0603CRNPO9BN6R8-Yageo-datasheet-182029515.pdf?src-supplier=Farnell; ComponentLink3URL: https://datasheet.octopart.com:443/CC0603CRNPO9BN6R8-Yageo-datasheet-151948684.pdf?src-supplier=element14+APAC; ComponentLink3Description: https://datasheet.octopart.com:443/CC0603CRNPO9BN6R8-Yageo-datasheet-151948684.pdf?src-supplier=element14+APAC; ComponentLink4URL: https://datasheet.octopart.com:443/CC0603CRNPO9BN6R8-Yageo-Group-datasheet-189192896.pdf?src-supplier=TME; ComponentLink4Description: https://datasheet.octopart.com:443/CC0603CRNPO9BN6R8-Yageo-Group-datasheet-189192896.pdf?src-supplier=TME; ComponentLink5URL: https://datasheet.octopart.com:443/CC0603CRNPO9BN6R8-Yageo-Group-datasheet-188129580.pdf?src-supplier=LCSC; ComponentLink5Description: https://datasheet.octopart.com:443/CC0603CRNPO9BN6R8-Yageo-Group-datasheet-188129580.pdf?src-supplier=LCSC; ComponentLink6URL: https://datasheet.octopart.com:443/CC0603CRNPO9BN6R8-Yageo-datasheet-137875056.pdf?src-supplier=Future+Electronics; ComponentLink6Description: https://datasheet.octopart.com:443/CC0603CRNPO9BN6R8-Yageo-datasheet-137875056.pdf?src-supplier=Future+Electronics; ComponentLink7URL: https://datasheet.octopart.com:443/CC0603CRNPO9BN6R8-Yageo-datasheet-136957424.pdf?src-supplier=Future+Electronics; ComponentLink7Description: https://datasheet.octopart.com:443/CC0603CRNPO9BN6R8-Yageo-datasheet-136957424.pdf?src-supplier=Future+Electronics; ComponentLink8URL: https://datasheet.octopart.com:443/CC0603CRNPO9BN6R8-Yageo-datasheet-137700082.pdf?src-supplier=Future+Electronics; ComponentLink8Description: https://datasheet.octopart.com:443/CC0603CRNPO9BN6R8-Yageo-datasheet-137700082.pdf?src-supplier=Future+Electronics; ComponentLink9URL: https://datasheet.octopart.com:443/CC0603CRNPO9BN6R8-Yageo-datasheet-78855684.pdf?src-supplier=Future+Electronics; ComponentLink9Description: https://datasheet.octopart.com:443/CC0603CRNPO9BN6R8-Yageo-datasheet-78855684.pdf?src-supplier=Future+Electronics; ComponentLink10URL: https://datasheet.octopart.com:443/CC0603CRNPO9BN6R8-Yageo-datasheet-16730043.pdf?src-supplier=Future+Electronics; ComponentLink10Description: https://datasheet.octopart.com:443/CC0603CRNPO9BN6R8-Yageo-datasheet-16730043.pdf?src-supplier=Future+Electronics; ComponentLink11URL: https://datasheet.octopart.com:443/CC0603CRNPO9BN6R8-Yageo-datasheet-12589826.pdf?src-supplier=Future+Electronics; ComponentLink11Description: https://datasheet.octopart.com:443/CC0603CRNPO9BN6R8-Yageo-datasheet-12589826.pdf?src-supplier=Future+Electronics; ComponentLink12URL: https://datasheet.octopart.com:443/CC0603CRNPO9BN6R8-Yageo-datasheet-10406438.pdf?src-supplier=Future+Electronics; ComponentLink12Description: https://datasheet.octopart.com:443/CC0603CRNPO9BN6R8-Yageo-datasheet-10406438.pdf?src-supplier=Future+Electronics; ComponentLink13URL: https://datasheet.octopart.com:443/CC0603CRNPO9BN6R8-Yageo-datasheet-8817079.pdf?src-supplier=Future+Electronics; ComponentLink13Description: https://datasheet.octopart.com:443/CC0603CRNPO9BN6R8-Yageo-datasheet-8817079.pdf?src-supplier=Future+Electronics; ComponentLink14URL: https://datasheet.octopart.com:443/CC0603CRNPO9BN6R8-Yageo-datasheet-8324240.pdf?src-supplier=Future+Electronics; ComponentLink14Description: https://datasheet.octopart.com:443/CC0603CRNPO9BN6R8-Yageo-datasheet-8324240.pdf?src-supplier=Future+Electronics; ComponentLink15URL: https://datasheet.octopart.com:443/CC0603CRNPO9BN6R8-Yageo-datasheet-504625.pdf?src-supplier=Future+Electronics; ComponentLink15Description: https://datasheet.octopart.com:443/CC0603CRNPO9BN6R8-Yageo-datasheet-504625.pdf?src-supplier=Future+Electronics; ComponentLink16URL: https://datasheet.octopart.com:443/CC0603CRNPO9BN6R8-Yageo-datasheet-5321569.pdf?src-supplier=Future+Electronics; ComponentLink16Description: https://datasheet.octopart.com:443/CC0603CRNPO9BN6R8-Yageo-datasheet-5321569.pdf?src-supplier=Future+Electronics; ComponentLink17URL: https://datasheet.octopart.com:443/CC0603CRNPO9BN6R8-Yageo-datasheet-8643175.pdf?src-supplier=SOS+electronic; ComponentLink17Description: https://datasheet.octopart.com:443/CC0603CRNPO9BN6R8-Yageo-datasheet-8643175.pdf?src-supplier=SOS+electronic; ComponentLink18URL: http://sigma.octopart.com:80/conflict_mineral_statement/Yageo-company-3.pdf?src-supplier=Compliance+Statements; ComponentLink18Description: http://sigma.octopart.com:80/conflict_mineral_statement/Yageo-company-3.pdf?src-supplier=Compliance+Statements; ComponentLink19URL: http://sigma.octopart.com:80/rohs_statement/Yageo-company-2.pdf?src-supplier=Compliance+Statements; ComponentLink19Description: http://sigma.octopart.com:80/rohs_statement/Yageo-company-2.pdf?src-supplier=Compliance+Statements; JLCPCB Part Number: C282251
C26 C27 C29-C31 = CC0603JRNPO9BN102: 50V 1nF NP0 ±5% 0603 Multilayer Ceramic Capacitors MLCC - SMD/SMT ROHS; Manufacturer: Yageo Group; Dielectric: C0G; Temperature Coefficient: 30ppm/°C; Supplier: Avnet; Supplier Part Number: CC0603JRNPO9BN102; Manufacturer Part Number: CC0603JRNPO9BN102; RoHS: Compliant; Category: Ceramic Capacitors; Stock: 4000; Pricing: 4000=0.02, 12000=0.019, 20000=0.018 (USD); Value: 1nF; Case/Package: 0603; Case Code (Imperial): 0603; Case Code (Metric): 1608; China RoHS: Compliant; Composition: Ceramic; Country of Origin: Mainland China, Taiwan; Depth: 800µm; Dielectric Material: Ceramic; Export Control Classification Number (ECCN) Code: EAR99; Halogen Free: Halogen Free; Height: 800µm; Harmonized Tariff Schedule (HTS) Code: 8532.24.00.20; Introduction Date: 2009-04-16; Lead Free: Lead Free; Length: 1.6mm; Lifecycle Status: Production; Material: Ceramic; Max Operating Temperature: 125°C; Min Operating Temperature: -55°C; Mounting Technology: Surface Mount; Pins: 2; Number of Terminals: 2; Packaging: Digi-Reel®; Radiation Hardening: No; REACH SVHC: Unaffected; Schedule B: 8532240020, 8532240020|8532240020, 8532240020|8532240020|8532240020, 8532240020|8532240020|8532240020|8532240020; Termination: SMD/SMT; Thickness: 889µm; Tolerance: 5%; Voltage: 50V; Voltage Rating: 50V; Voltage Rating (DC): 50V; Width: 800µm; ComponentLink1URL: https://datasheet.octopart.com:443/CC0603JRNPO9BN102-Yageo-datasheet-182140217.pdf?src-supplier=IHS; ComponentLink1Description: https://datasheet.octopart.com:443/CC0603JRNPO9BN102-Yageo-datasheet-182140217.pdf?src-supplier=IHS; ComponentLink2URL: https://datasheet.octopart.com:443/CC0603JRNPO9BN102-Yageo-datasheet-137875056.pdf?src-supplier=Future+Electronics; ComponentLink2Description: https://datasheet.octopart.com:443/CC0603JRNPO9BN102-Yageo-datasheet-137875056.pdf?src-supplier=Future+Electronics; ComponentLink3URL: https://datasheet.octopart.com:443/CC0603JRNPO9BN102-Yageo-datasheet-136957424.pdf?src-supplier=Future+Electronics; ComponentLink3Description: https://datasheet.octopart.com:443/CC0603JRNPO9BN102-Yageo-datasheet-136957424.pdf?src-supplier=Future+Electronics; ComponentLink4URL: https://datasheet.octopart.com:443/CC0603JRNPO9BN102-Yageo-datasheet-137700082.pdf?src-supplier=Future+Electronics; ComponentLink4Description: https://datasheet.octopart.com:443/CC0603JRNPO9BN102-Yageo-datasheet-137700082.pdf?src-supplier=Future+Electronics; ComponentLink5URL: https://datasheet.octopart.com:443/CC0603JRNPO9BN102-Yageo-datasheet-78855684.pdf?src-supplier=Future+Electronics; ComponentLink5Description: https://datasheet.octopart.com:443/CC0603JRNPO9BN102-Yageo-datasheet-78855684.pdf?src-supplier=Future+Electronics; ComponentLink6URL: https://datasheet.octopart.com:443/CC0603JRNPO9BN102-Yageo-datasheet-16730043.pdf?src-supplier=Future+Electronics; ComponentLink6Description: https://datasheet.octopart.com:443/CC0603JRNPO9BN102-Yageo-datasheet-16730043.pdf?src-supplier=Future+Electronics; ComponentLink7URL: https://datasheet.octopart.com:443/CC0603JRNPO9BN102-Yageo-datasheet-12589826.pdf?src-supplier=Future+Electronics; ComponentLink7Description: https://datasheet.octopart.com:443/CC0603JRNPO9BN102-Yageo-datasheet-12589826.pdf?src-supplier=Future+Electronics; ComponentLink8URL: https://sigma.octopart.com:443/147830939/technical_drawing/Yageo-CC0603JRNPO9BN102.pdf?src-supplier=Upverter; ComponentLink8Description: https://sigma.octopart.com:443/147830939/technical_drawing/Yageo-CC0603JRNPO9BN102.pdf?src-supplier=Upverter; ComponentLink9URL: https://datasheet.octopart.com:443/CC0603JRNPO9BN102-Yageo-datasheet-10406438.pdf?src-supplier=element14+APAC; ComponentLink9Description: https://datasheet.octopart.com:443/CC0603JRNPO9BN102-Yageo-datasheet-10406438.pdf?src-supplier=element14+APAC; ComponentLink10URL: https://datasheet.octopart.com:443/CC0603JRNPO9BN102-Yageo-datasheet-67645495.pdf?src-supplier=element14+APAC; ComponentLink10Description: https://datasheet.octopart.com:443/CC0603JRNPO9BN102-Yageo-datasheet-67645495.pdf?src-supplier=element14+APAC; ComponentLink11URL: https://datasheet.octopart.com:443/CC0603JRNPO9BN102-Yageo-datasheet-10882999.pdf?src-supplier=element14+APAC; ComponentLink11Description: https://datasheet.octopart.com:443/CC0603JRNPO9BN102-Yageo-datasheet-10882999.pdf?src-supplier=element14+APAC; ComponentLink12URL: https://datasheet.octopart.com:443/CC0603JRNPO9BN102-Yageo-datasheet-151948684.pdf?src-supplier=Newark; ComponentLink12Description: https://datasheet.octopart.com:443/CC0603JRNPO9BN102-Yageo-datasheet-151948684.pdf?src-supplier=Newark; ComponentLink13URL: https://datasheet.octopart.com:443/CC0603JRNPO9BN102-Yageo-datasheet-181968167.pdf?src-supplier=Newark; ComponentLink13Description: https://datasheet.octopart.com:443/CC0603JRNPO9BN102-Yageo-datasheet-181968167.pdf?src-supplier=Newark; ComponentLink14URL: https://datasheet.octopart.com:443/CC0603JRNPO9BN102-Yageo-datasheet-181968166.pdf?src-supplier=Newark; ComponentLink14Description: https://datasheet.octopart.com:443/CC0603JRNPO9BN102-Yageo-datasheet-181968166.pdf?src-supplier=Newark; ComponentLink15URL: https://datasheet.octopart.com:443/CC0603JRNPO9BN102-Yageo-datasheet-65873193.pdf?src-supplier=Farnell; ComponentLink15Description: https://datasheet.octopart.com:443/CC0603JRNPO9BN102-Yageo-datasheet-65873193.pdf?src-supplier=Farnell; ComponentLink16URL: https://datasheet.octopart.com:443/CC0603JRNPO9BN102-Yageo-datasheet-8817079.pdf?src-supplier=element14; ComponentLink16Description: https://datasheet.octopart.com:443/CC0603JRNPO9BN102-Yageo-datasheet-8817079.pdf?src-supplier=element14; ComponentLink17URL: https://datasheet.octopart.com:443/CC0603JRNPO9BN102-Yageo-datasheet-8324240.pdf?src-supplier=element14; ComponentLink17Description: https://datasheet.octopart.com:443/CC0603JRNPO9BN102-Yageo-datasheet-8324240.pdf?src-supplier=element14; ComponentLink18URL: https://datasheet.octopart.com:443/CC0603JRNPO9BN102-Yageo-datasheet-504625.pdf?src-supplier=element14; ComponentLink18Description: https://datasheet.octopart.com:443/CC0603JRNPO9BN102-Yageo-datasheet-504625.pdf?src-supplier=element14; ComponentLink19URL: https://datasheet.octopart.com:443/CC0603JRNPO9BN102-Yageo-datasheet-5321569.pdf?src-supplier=element14; ComponentLink19Description: https://datasheet.octopart.com:443/CC0603JRNPO9BN102-Yageo-datasheet-5321569.pdf?src-supplier=element14; ComponentLink20URL: https://datasheet.octopart.com:443/CC0603JRNPO9BN102-Yageo-Group-datasheet-188129580.pdf?src-supplier=LCSC; ComponentLink20Description: https://datasheet.octopart.com:443/CC0603JRNPO9BN102-Yageo-Group-datasheet-188129580.pdf?src-supplier=LCSC; ComponentLink21URL: https://datasheet.octopart.com:443/CC0603JRNPO9BN102-Yageo-datasheet-8555986.pdf?src-supplier=TME; ComponentLink21Description: https://datasheet.octopart.com:443/CC0603JRNPO9BN102-Yageo-datasheet-8555986.pdf?src-supplier=TME; ComponentLink22URL: https://datasheet.octopart.com:443/CC0603JRNPO9BN102-Yageo-datasheet-68296204.pdf?src-supplier=Megastar; ComponentLink22Description: https://datasheet.octopart.com:443/CC0603JRNPO9BN102-Yageo-datasheet-68296204.pdf?src-supplier=Megastar; ComponentLink23URL: http://sigma.octopart.com:80/conflict_mineral_statement/Yageo-company-3.pdf?src-supplier=Compliance+Statements; ComponentLink23Description: http://sigma.octopart.com:80/conflict_mineral_statement/Yageo-company-3.pdf?src-supplier=Compliance+Statements; ComponentLink24URL: http://sigma.octopart.com:80/rohs_statement/Yageo-company-2.pdf?src-supplier=Compliance+Statements; ComponentLink24Description: http://sigma.octopart.com:80/rohs_statement/Yageo-company-2.pdf?src-supplier=Compliance+Statements; JLCPCB Part Number: C106246